# EAGLE schematic Remote_Board_V2.0 (EAGLE 9.6.2)
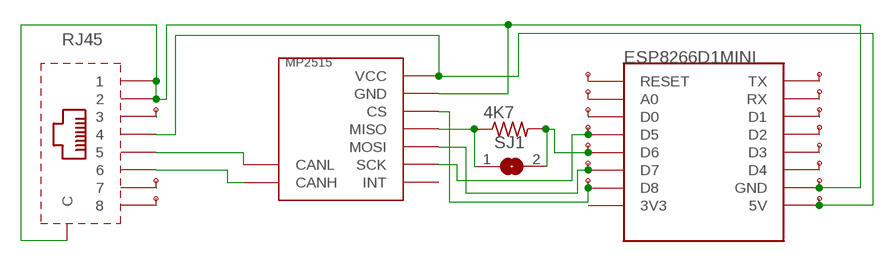
[diagram p0: schematic, sheet 1]

## Parts
4K7  R-US_0207/10  [0207/10]
ESP8266D1MINI  WEMOS-D1-MINI_SEM_LAYOUT  [WEMOS-D1-MINI_SEM_LAYOUT]
RJ45  ALI-RJ45_SEM_LAYOUT  [ALI-RJ45_SEM_LAYOUT]
SJ1  SJ  [SJ]
U$1  TP  [TP]
U$2  TP  [TP]
U$3  TP  [TP]
U$4  TP  [TP]
U$5  TP  [TP]
U$6  TP  [TP]
U$7  TP  [TP]
U$8  TP  [TP]
U$9  TP  [TP]
U$10  TP  [TP]
U$11  TP  [TP]
U$12  TP  [TP]
U$13  TP  [TP]
U$14  TP  [TP]
U$15  TP  [TP]
U$16  TP  [TP]
U$17  TP  [TP]
U$18  TP  [TP]
U$31  MCP2515_MODULE_SEM_LAYOUT  [MCP2515_MODULE_SEM_LAYOUT]

## Nets
GND [GND]: ESP8266D1MINI.GND RJ45.1 RJ45.2 RJ45.P$1(C) RJ45.P$2(C) U$15.P$1 U$31.GND
N$1 [+3.3V]: RJ45.3 U$10.P$1
N$2: RJ45.7 U$17.P$1
N$3: RJ45.8 U$18.P$1
N$4: ESP8266D1MINI.RESET U$1.P$1
N$5: ESP8266D1MINI.A0 U$2.P$1
N$6: ESP8266D1MINI.D0 U$3.P$1
N$7: ESP8266D1MINI.D5 U$4.P$1 U$31.SCK
N$8: 4K7.2 ESP8266D1MINI.D6 SJ1.2 U$5.P$1
N$9: ESP8266D1MINI.D7 U$8.P$1 U$31.MOSI
N$10: ESP8266D1MINI.D8 U$9.P$1 U$31.CS
N$11: RJ45.5 U$31.CL(CANL)
N$12: RJ45.6 U$31.CH(CANH)
N$13: ESP8266D1MINI.D4 U$14.P$1
N$14: ESP8266D1MINI.D3 U$13.P$1
N$15: ESP8266D1MINI.D2 U$12.P$1
N$16: ESP8266D1MINI.D1 U$11.P$1
N$17: ESP8266D1MINI.RX U$7.P$1
N$18: ESP8266D1MINI.TX U$6.P$1
N$19: 4K7.1 SJ1.1 U$31.MISO
N$21 [+5V]: ESP8266D1MINI.5V RJ45.4 U$16.P$1 U$31.VCC
Unconnected: ESP8266D1MINI.3V3 U$31.INT

## Library data of the parts
4K7 = rcl:R-US_: RESISTOR, American symbol; SPICEPREFIX: R
ESP8266D1MINI = esp8266modules:WEMOS-D1-MINI_SEM_LAYOUT: WeMos.cc D1 mini ESP8266 module
RJ45 = AliExpressRJ45:ALI-RJ45_SEM_LAYOUT
SJ1 = jumper:SJ: SMD solder JUMPER
U$1-U$18 = edurobotParts:TP
U$31 = MCP2515_Module:MCP2515_MODULE_SEM_LAYOUT

## Net classes
0 default: width 0.15 mm
1 +5V: width 0.305 mm
2 GND: width 0.305 mm
3 +3.3V: width 0.305 mm
4 SCL: width 0.15 mm
5 SDA: width 0.15 mm